# EAGLE design mini-v1.8-seed (EAGLE 7.2.0)

## Sheet 1 of 4: Main Microcontroller
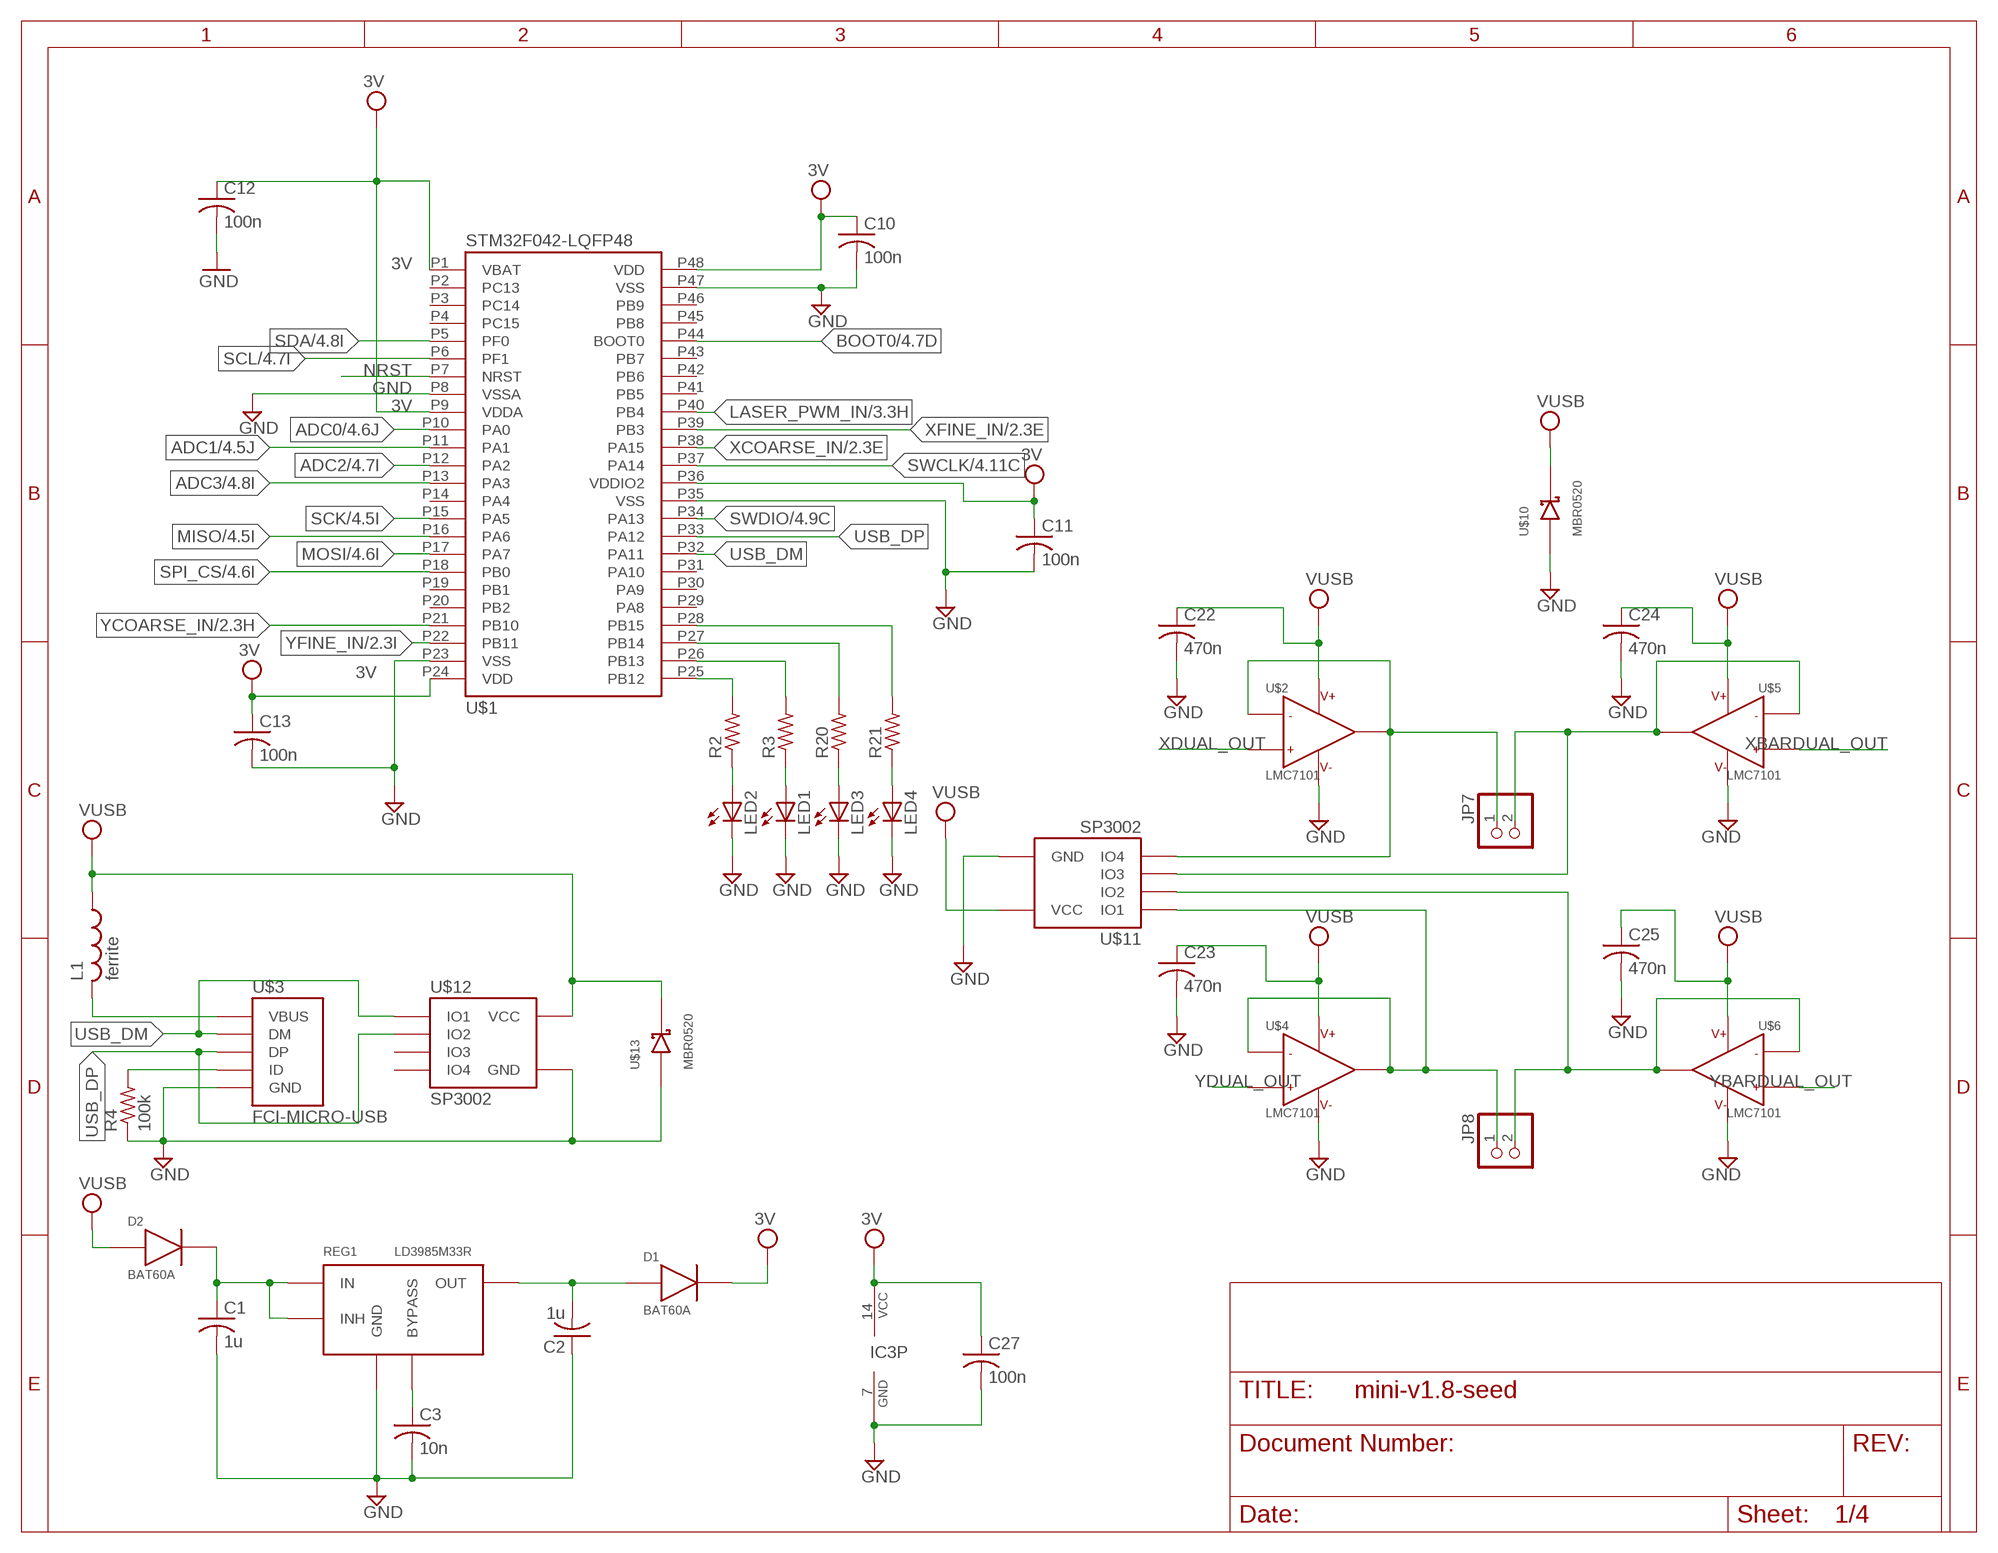
[diagram p0: schematic, sheet 1]

### Parts
C1  1u  C-USC0603  [C0603]
C2  1u  C-USC0603  [C0603]
C3  10n  C-USC0603  [C0603]
C10  100n  C-USC0603  [C0603]
C11  100n  C-USC0603  [C0603]
C12  100n  C-USC0603  [C0603]
C13  100n  C-USC0603  [C0603]
C22  470n  C-USC0603  [C0603]
C23  470n  C-USC0603  [C0603]
C24  470n  C-USC0603  [C0603]
C25  470n  C-USC0603  [C0603]
C27  100n  C-USC0603  [C0603]
D1  BAT60A  [SOD323]
D2  BAT60A  [SOD323]
IC3  74S04D  [SO14]
JP7  PINHD-1X2  [1X02]
JP8  PINHD-1X2  [1X02]
L1  ferrite  L-US  [C0603]
LED1  LEDCHIP-LED0603  [CHIP-LED0603]
LED2  LEDCHIP-LED0603  [CHIP-LED0603]
LED3  LEDCHIP-LED0603  [CHIP-LED0603]
LED4  LEDCHIP-LED0603  [CHIP-LED0603]
R2  R-US_R0603  [R0603]
R3  R-US_R0603  [R0603]
R4  100k  R-US_R0603  [R0603]
R20  R-US_R0603  [R0603]
R21  R-US_R0603  [R0603]
REG1  LD3985M33R  LD3985MXXR  [SOT23-5L]
U$1  STM32F042-LQFP48  [LQFP48]
U$2  LMC7101  [SOT23-5]
U$3  FCI-MICRO-USB  [FCI-MICROUSB]
U$4  LMC7101  [SOT23-5]
U$5  LMC7101  [SOT23-5]
U$6  LMC7101  [SOT23-5]
U$10  MBR0520  [SOD123]
U$11  SP3002  [SC70-6]
U$12  SP3002  [SC70-6]
U$13  MBR0520  [SOD123]

### Nets
3V: C10.1 C11.1 C12.1 C13.1 C27.1 D1.1 IC3.14(P:VCC) U$1.P1(VBAT) U$1.P9(VDDA) U$1.P24(VDD) U$1.P36(VDDIO2) U$1.P48(VDD) ; also sheet 4
3V3: C2.2 D1.2 REG1.OUT
ADC0: U$1.P10(PA0) ; also sheet 4
ADC1: U$1.P11(PA1) ; also sheet 4
ADC2: U$1.P12(PA2) ; also sheet 4
ADC3: U$1.P13(PA3) ; also sheet 4
BOOT0: U$1.P44(BOOT0) ; also sheet 4
GND [Power]: C1.2 C2.1 C3.2 C10.2 C11.2 C12.2 C13.2 C22.2 C23.2 C24.2 C25.2 C27.2 IC3.7(P:GND) LED1.C LED2.C LED3.C LED4.C R4.1 REG1.GND U$1.P8(VSSA) U$1.P23(VSS) U$1.P35(VSS) U$1.P47(VSS) U$2.5 U$3.P5(GND) U$4.5 U$5.5 U$6.5 U$10.ANODE U$11.P2(GND) U$12.P2(GND) U$13.ANODE ; also sheet 2,3,4
LASER_PWM_IN: U$1.P40(PB4) ; also sheet 3
MISO: U$1.P16(PA6) ; also sheet 4
MOSI: U$1.P17(PA7) ; also sheet 4
N$1: C3.1 REG1.BYPASS
N$2: R2.2 U$1.P25(PB12)
N$3: LED2.A R2.1
N$4: C1.1 D2.1 REG1.IN REG1.INHIBIT(INH)
N$5: R4.2 U$3.P4(ID)
N$7: JP7.1 U$2.1 U$2.4 U$11.P6(IO4)
N$9: JP8.1 U$4.1 U$4.4 U$11.P1(IO1)
N$12: LED1.A R3.1
N$13: R3.2 U$1.P26(PB13)
N$14: L1.2 U$3.P1(VBUS)
N$16: JP7.2 U$5.1 U$5.4 U$11.P4(IO3)
N$17: JP8.2 U$6.1 U$6.4 U$11.P3(IO2)
N$24: LED3.A R20.1
N$27: LED4.A R21.1
N$28: R20.2 U$1.P27(PB14)
N$29: R21.2 U$1.P28(PB15)
NRST: U$1.P7(NRST) ; also sheet 4
SCK: U$1.P15(PA5) ; also sheet 4
SCL: U$1.P6(PF1) ; also sheet 4
SDA: U$1.P5(PF0) ; also sheet 4
SPI_CS: U$1.P18(PB0) ; also sheet 4
SWCLK: U$1.P37(PA14) ; also sheet 4
SWDIO: U$1.P34(PA13) ; also sheet 4
USB_DM: U$1.P32(PA11) U$3.P2(DM) U$12.P1(IO1)
USB_DP: U$1.P33(PA12) U$3.P3(DP) U$12.P3(IO2)
VUSB [Power]: C22.1 C23.1 C24.1 C25.1 D2.2 L1.1 U$2.2 U$4.2 U$5.2 U$6.2 U$10.CATHODE U$11.P5(VCC) U$12.P5(VCC) U$13.CATHODE ; also sheet 3
XBARDUAL_OUT: U$5.3 ; also sheet 2
XCOARSE_IN: U$1.P38(PA15) ; also sheet 2
XDUAL_OUT: U$2.3 ; also sheet 2
XFINE_IN: U$1.P39(PB3) ; also sheet 2
YBARDUAL_OUT: U$6.3 ; also sheet 2
YCOARSE_IN: U$1.P21(PB10) ; also sheet 2
YDUAL_OUT: U$4.3 ; also sheet 2
YFINE_IN: U$1.P22(PB11) ; also sheet 2
Unconnected: U$1.P2(PC13) U$1.P3(PC14) U$1.P4(PC15) U$1.P14(PA4) U$1.P19(PB1) U$1.P20(PB2) U$1.P29(PA8) U$1.P30(PA9) U$1.P31(PA10) U$1.P41(PB5) U$1.P42(PB6) U$1.P43(PB7) U$1.P45(PB8) U$1.P46(PB9) U$12.P4(IO3) U$12.P6(IO4)

## Sheet 2 of 4: Dual PWM
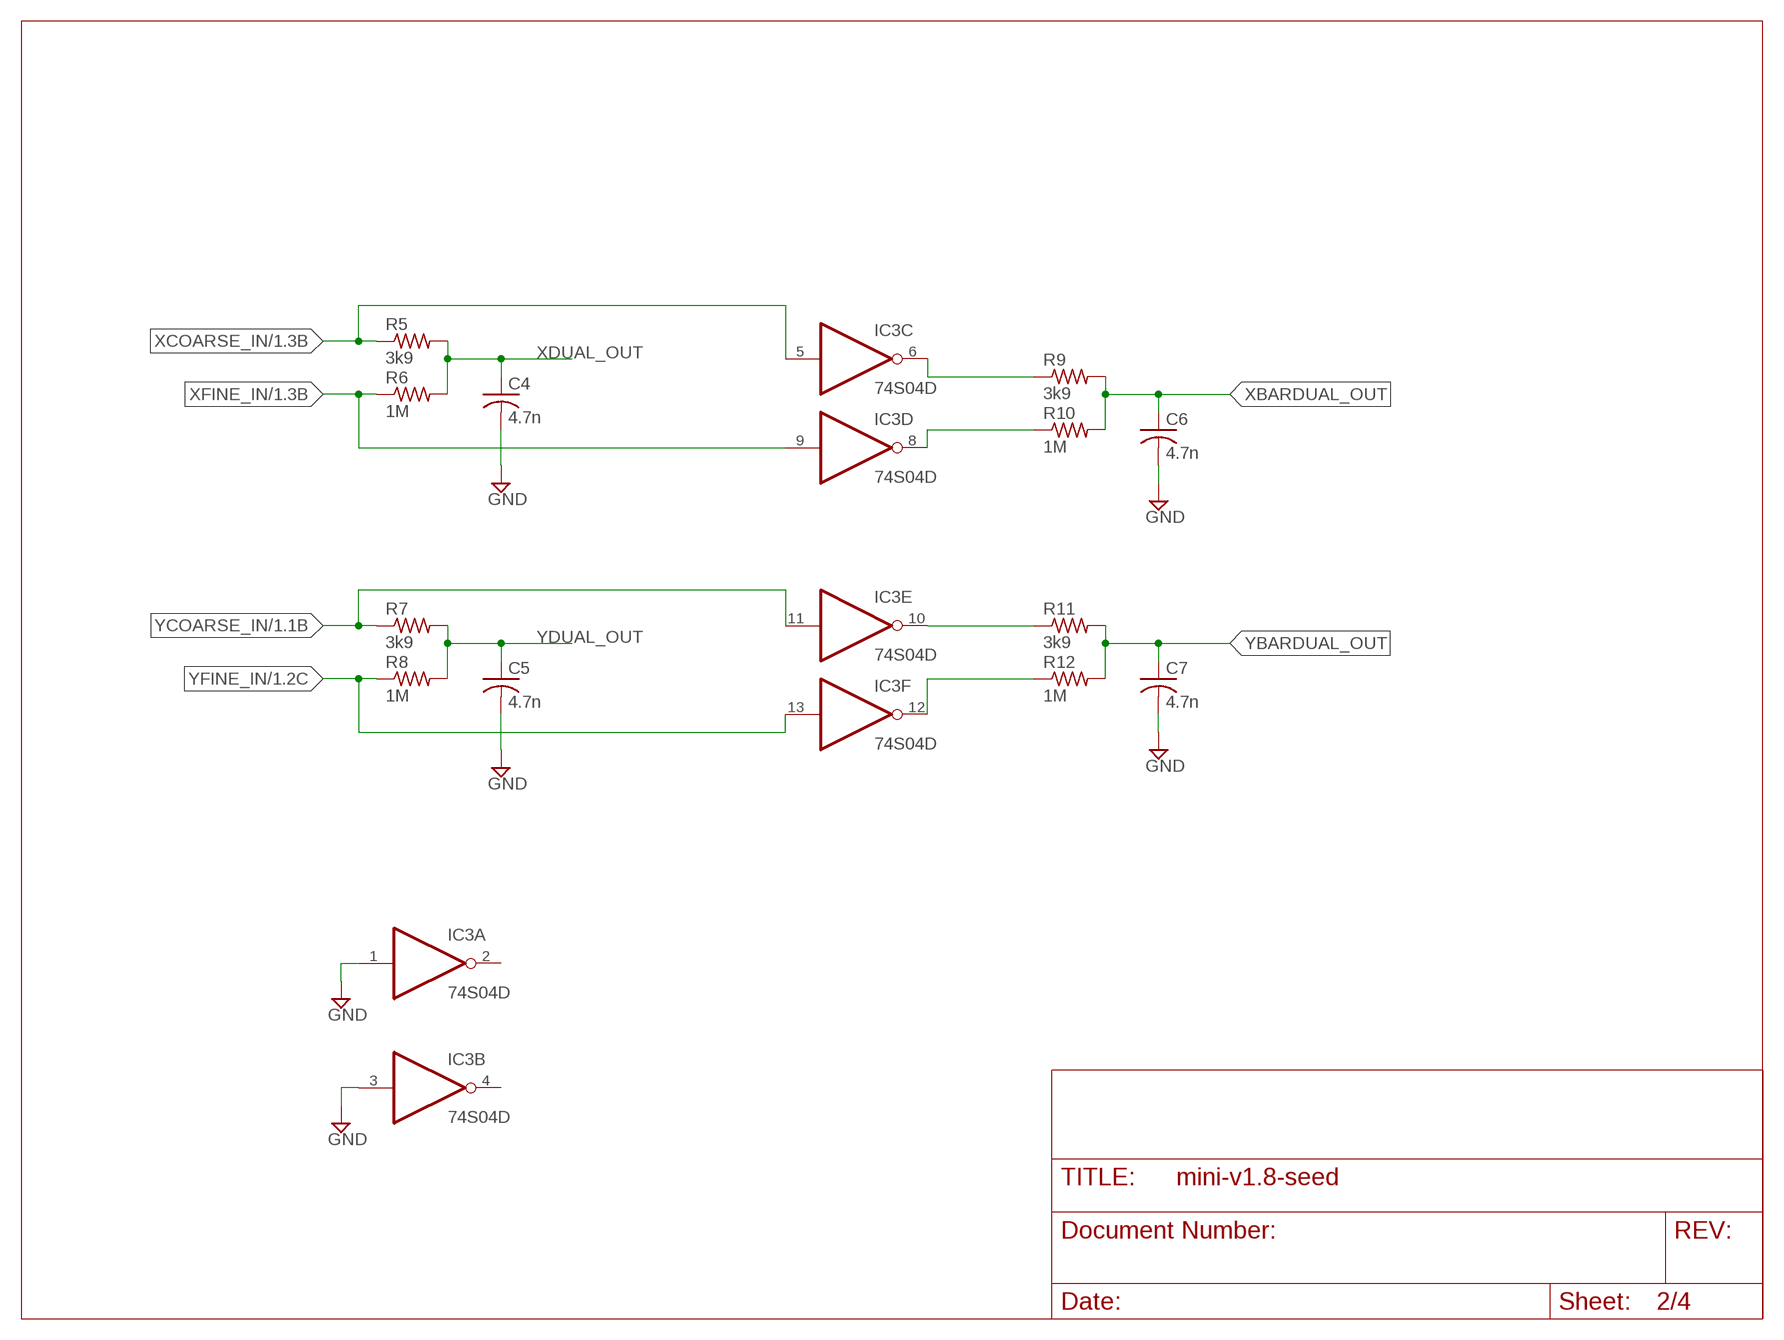
[diagram p1: schematic, sheet 2]

### Parts
C4  4.7n  C-USC0603  [C0603]
C5  4.7n  C-USC0603  [C0603]
C6  4.7n  C-USC0603  [C0603]
C7  4.7n  C-USC0603  [C0603]
R5  3k9  R-US_R0603  [R0603]
R6  1M  R-US_R0603  [R0603]
R7  3k9  R-US_R0603  [R0603]
R8  1M  R-US_R0603  [R0603]
R9  3k9  R-US_R0603  [R0603]
R10  1M  R-US_R0603  [R0603]
R11  3k9  R-US_R0603  [R0603]
R12  1M  R-US_R0603  [R0603]

### Nets
GND [Power]: C4.2 C5.2 C6.2 C7.2 IC3.1(A:I) IC3.3(B:I) ; also sheet 1,3,4
N$6: IC3.10(E:O) R11.1
N$8: IC3.12(F:O) R12.1
N$10: IC3.8(D:O) R10.1
N$11: IC3.6(C:O) R9.1
XBARDUAL_OUT: C6.1 R9.2 R10.2 ; also sheet 1
XCOARSE_IN: IC3.5(C:I) R5.1 ; also sheet 1
XDUAL_OUT: C4.1 R5.2 R6.2 ; also sheet 1
XFINE_IN: IC3.9(D:I) R6.1 ; also sheet 1
YBARDUAL_OUT: C7.1 R11.2 R12.2 ; also sheet 1
YCOARSE_IN: IC3.11(E:I) R7.1 ; also sheet 1
YDUAL_OUT: C5.1 R7.2 R8.2 ; also sheet 1
YFINE_IN: IC3.13(F:I) R8.1 ; also sheet 1
Unconnected: IC3.2(A:O) IC3.4(B:O)

## Sheet 3 of 4: Laser Power Driver
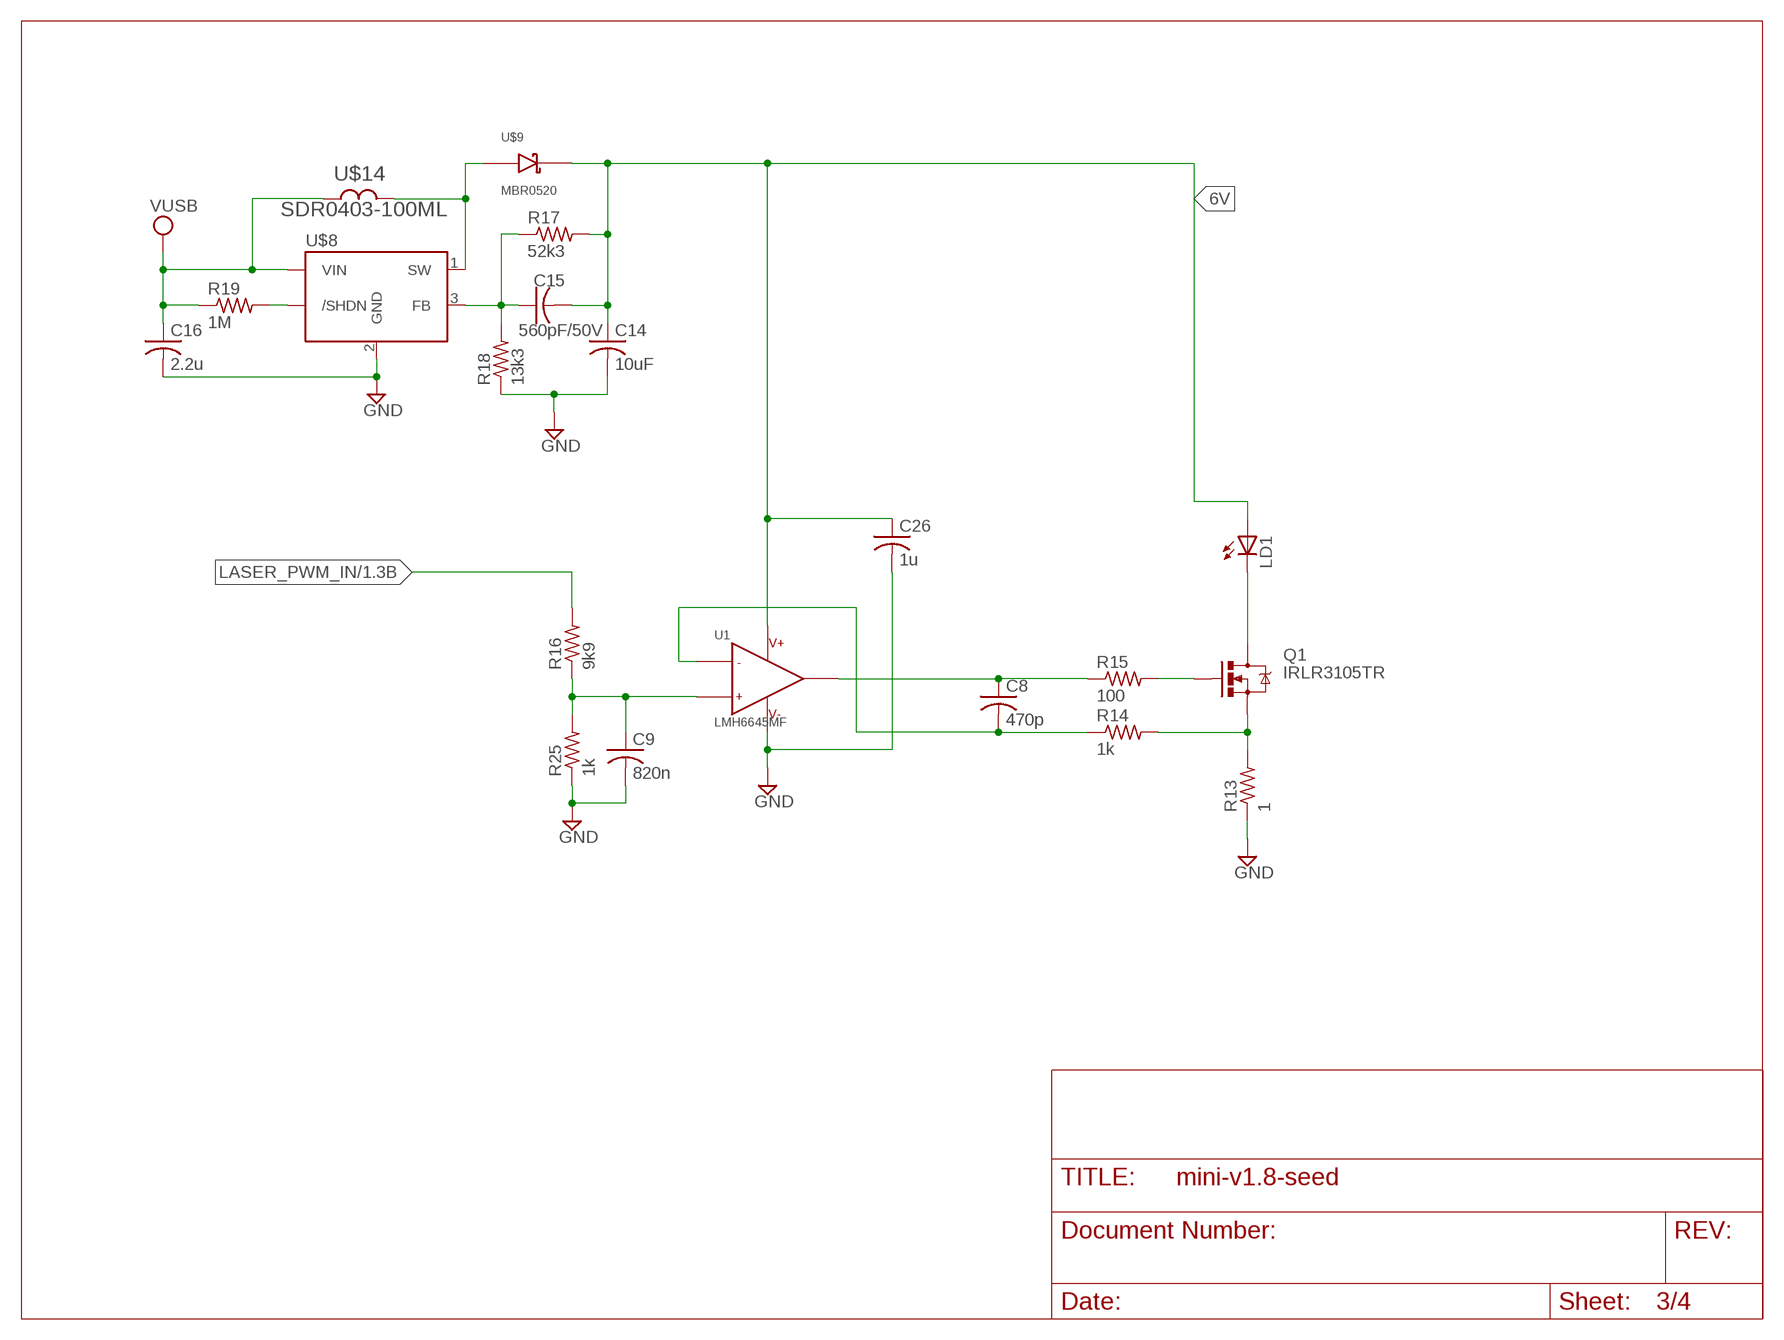
[diagram p2: schematic, sheet 3]

### Parts
C8  470p  C-USC0603  [C0603]
C9  820n  C-USC0603  [C0603]
C14  10uF  C-USC0603  [C0603]
C15  560pF/50V  C-USC0603  [C0603]
C16  2.2u  C-USC0603  [C0603]
C26  1u  C-USC0603  [C0603]
LD1  LASERDIODELD2  [LASERDIODE2]
Q1  IRLR3105TR  FET-N-IRLR3105TRIRLR3105TR  [DPAK]
R13  1  R-US_R0603  [R0603]
R14  1k  R-US_R0603  [R0603]
R15  100  R-US_R0603  [R0603]
R16  9k9  R-US_R0603  [R0603]
R17  52k3  R-US_R0603  [R0603]
R18  13k3  R-US_R0603  [R0603]
R19  1M  R-US_R0603  [R0603]
R25  1k  R-US_R0603  [R0603]
U1  LMH6645MF  OPAMP-SINGLELMH6645MF  [SOT23-5]
U$8  LMR62014  [SOT23-5]
U$9  MBR0520  [SOD123]
U$14  SDR0403-100ML  SDR0403  [SDR0403]

### Nets
6V [Power]: C14.1 C15.2 C26.1 LD1.P$1(A) R17.2 U1.5(V+) U$9.CATHODE
GND [Power]: C9.2 C14.2 C16.2 C26.2 R13.1 R18.1 R25.1 U1.2(V-) U$8.2(GND) ; also sheet 1,2,4
LASER_PWM_IN: R16.2 ; also sheet 1
N$15: U$8.1(SW) U$9.ANODE U$14.P$2
N$18: LD1.P$3(C) Q1.4(D)
N$19: Q1.3(S) R13.2 R14.2
N$20: C8.2 R14.1 U1.4(IN-)
N$21: Q1.1(G) R15.2
N$22: C8.1 R15.1 U1.1(OUT)
N$23: C9.1 R16.1 R25.2 U1.3(IN+)
N$25: C15.1 R17.1 R18.2 U$8.3(FB)
N$26: R19.2 U$8.4(/SHDN)
VUSB [Power]: C16.1 R19.1 U$8.5(VIN) U$14.P$1 ; also sheet 1

## Sheet 4 of 4
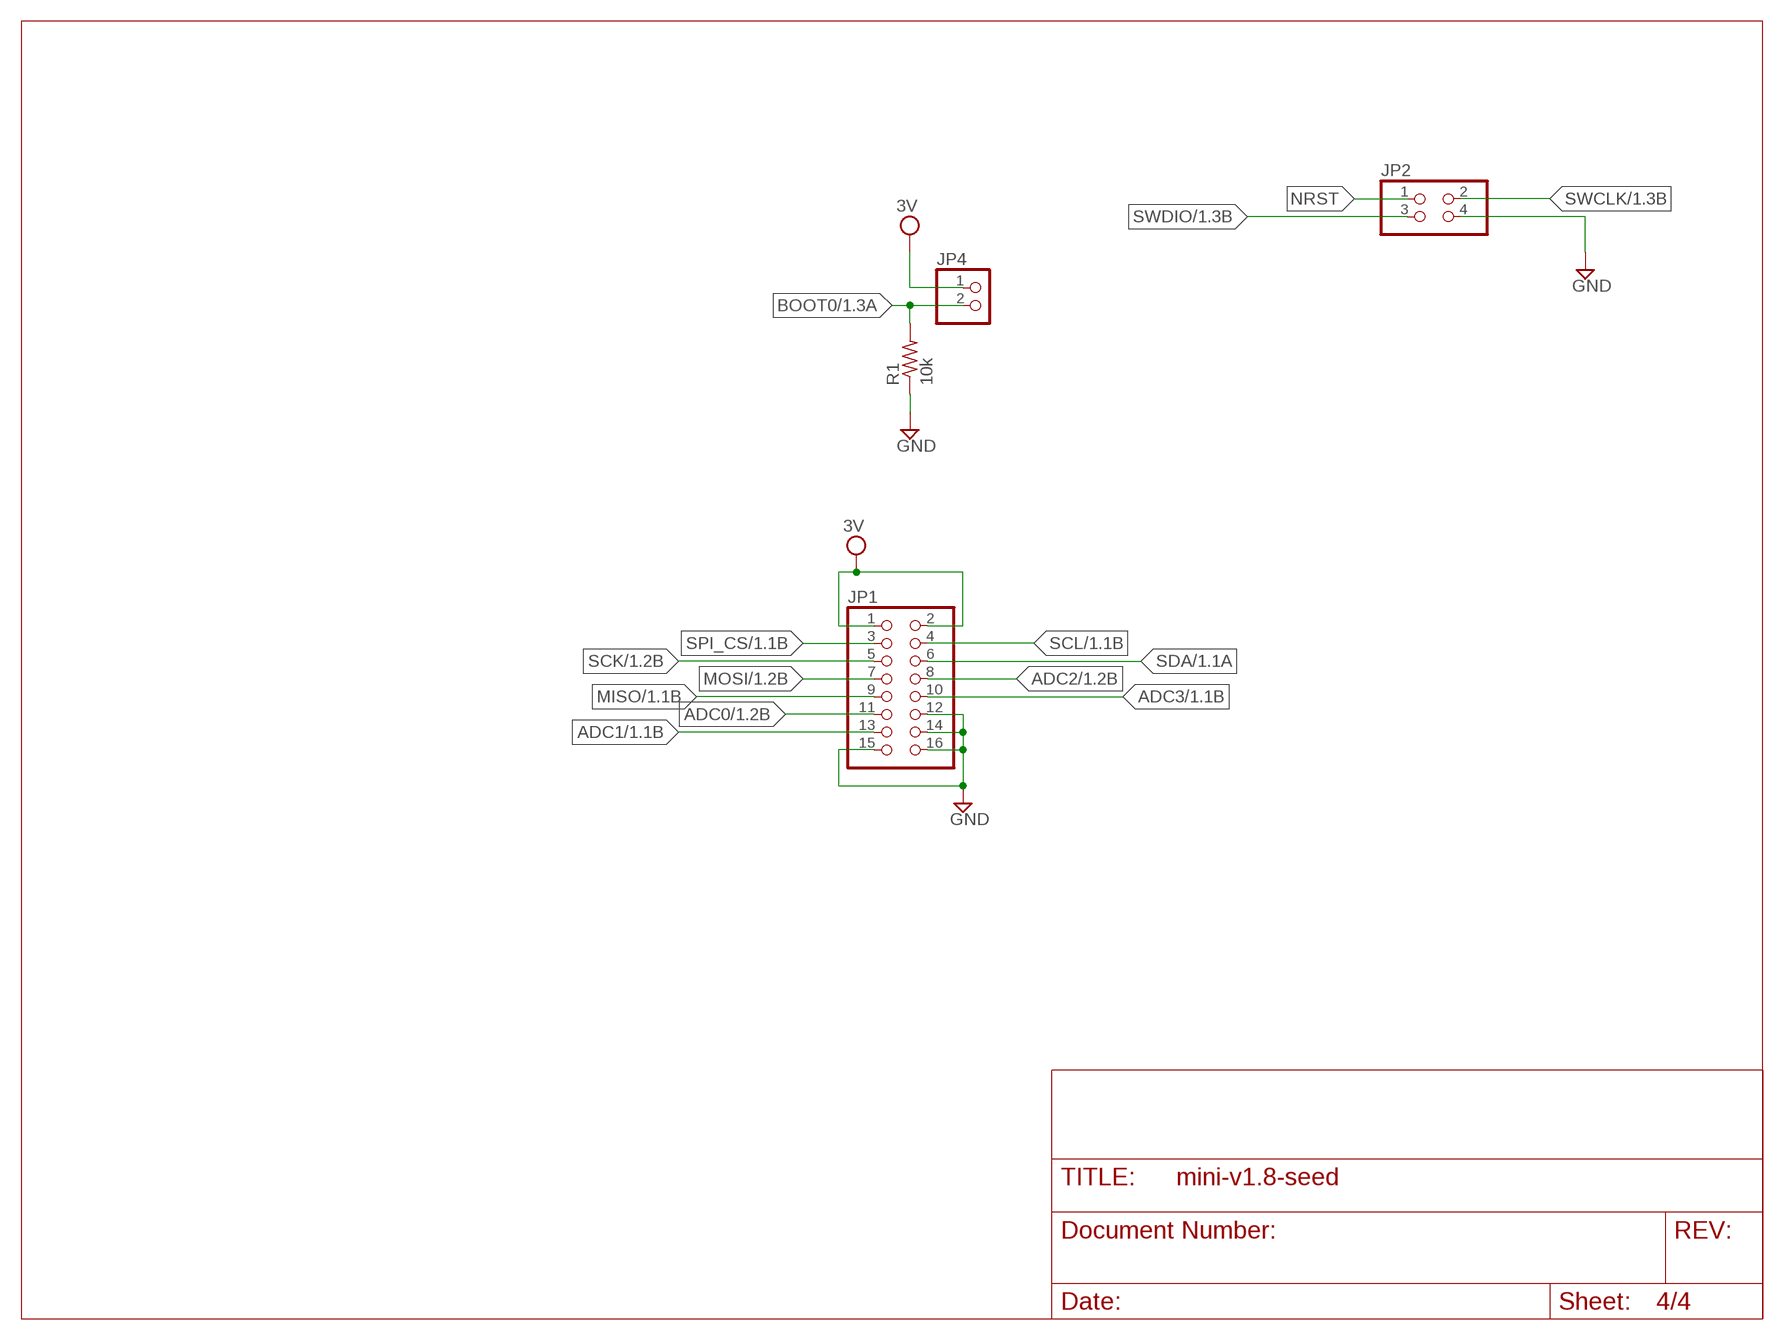
[diagram p3: schematic, sheet 4]

### Parts
JP1  PINHD-2X8  [2X08]
JP2  PINHD-2X2  [2X02]
JP4  PINHD-1X2  [1X02]
R1  10k  R-US_R0603  [R0603]

### Nets
3V: JP1.1 JP1.2 JP4.1 ; also sheet 1
ADC0: JP1.11 ; also sheet 1
ADC1: JP1.13 ; also sheet 1
ADC2: JP1.8 ; also sheet 1
ADC3: JP1.10 ; also sheet 1
BOOT0: JP4.2 R1.2 ; also sheet 1
GND [Power]: JP1.12 JP1.14 JP1.15 JP1.16 JP2.4 R1.1 ; also sheet 1,2,3
MISO: JP1.9 ; also sheet 1
MOSI: JP1.7 ; also sheet 1
NRST: JP2.1 ; also sheet 1
SCK: JP1.5 ; also sheet 1
SCL: JP1.4 ; also sheet 1
SDA: JP1.6 ; also sheet 1
SPI_CS: JP1.3 ; also sheet 1
SWCLK: JP2.2 ; also sheet 1
SWDIO: JP2.3 ; also sheet 1

## Library data of the parts
C1-C16 C22-C27 = rcl:C-US: CAPACITOR, American symbol
D1 D2 = lmdparts:BAT60A
IC3 = lmdparts:74*04: Hex INVERTER
JP1 = pinhead:PINHD-2X8: PIN HEADER
JP2 = pinhead:PINHD-2X2: PIN HEADER
JP4 JP7 JP8 = pinhead:PINHD-1X2: PIN HEADER
L1 = lmdparts:L-US: INDUCTOR, American symbol
LD1 = Scott:LASERDIODE; MPN: 3 x (0552-2-15-15-11-27-10-0)
LED1-LED4 = adafruit:LED: LED OSRAM: - CHIPLED LG R971, LG N971, LY N971, LG Q971, LY Q971, LO R971, LY R971 LH N974, LH R974 LS Q976, LO Q976, LY Q976 LO Q996 - Hyper CHIPLED LW Q18S LB Q993, LB Q99A, LB R99A - SideLED LS A670, LO A670, LY A670, LG A670, LP A670 LB A673, LV A673, LT A673, LW A673 LH A674 LY A675 LS A676, LA A676, LO A676, LY A676, LW A676 LS A679, LY A679, LG A679 - Hyper Micro SIDELED® LS Y876, LA Y876, LO Y876, LY Y876 LT Y87S - SmartLED LW L88C, LW L88S LB L89C, LB L89S, LG L890 LS L89K, LO L89K, LY L89K LS L896, LA L896, LO L896, LY L896 - TOPLED LS T670, LO T670, LY T670, LG T670, LP T670 LSG T670, LSP T670, LSY T670, LOP T670, LYG T670 LG T671, LOG T671, LSG T671 LB T673, LV T673, LT T673, LW T673 LH T674 LS T676, LA T676, LO T676, LY T676, LB T676, LH T676, LSB T676, LW T676 LB T67C, LV T67C, LT T67C, LS T67K, LO T67K, LY T67K, LW E67C LS E67B, LA E67B, LO E67B, LY E67B, LB E67C, LV E67C, LT E67C LW T67C LS T679, LY T679, LG T679 LS T770, LO T770, LY T770, LG T770, LP T770 LB T773, LV T773, LT T773, LW T773 LH T774 LS E675, LA E675, LY E675, LS T675 LS T776, LA T776, LO T776, LY T776, LB T776 LHGB T686 LT T68C, LB T68C - Hyper Mini TOPLED® LB M676 - Mini TOPLED Santana® LG M470 LS M47K, LO M47K, LY M47K Source: http://www.osram.convergy.de/
Q1 = lmdparts:FET-N-IRLR3105TR: Common NMOSFET Parts MFG P/N Store ID Prod ID FDD8780 TRANS-09984 SI7820DN TRANS-11055 FDS6630A IC-08089 2N7002PW TRANS-11151 FQP30N06L COM-10213 TRANS-10060 BSS123LT1G TRANS-08345 BSS138 TRANS-00830 BS170 2N7000; PROD_ID: TRANS-09984
R1-R21 R25 = rcl:R-US_: RESISTOR, American symbol
REG1 = lmdparts:LD3985MXXR
U1 = lmdparts:OPAMP-SINGLE: Single amp opamps
U$1 = lmdparts:STM32F042-LQFP48
U$2 U$4-U$6 = lmdparts:LMC7101
U$3 = lmdparts:FCI-MICRO-USB
U$8 = lmdparts:LMR62014
U$9 U$10 U$13 = lmdparts:MBR0520
U$11 U$12 = lmdparts:SP3002
U$14 = lmdparts:SDR0403

## Net classes
1 Power: width 0.305 mm

## Board
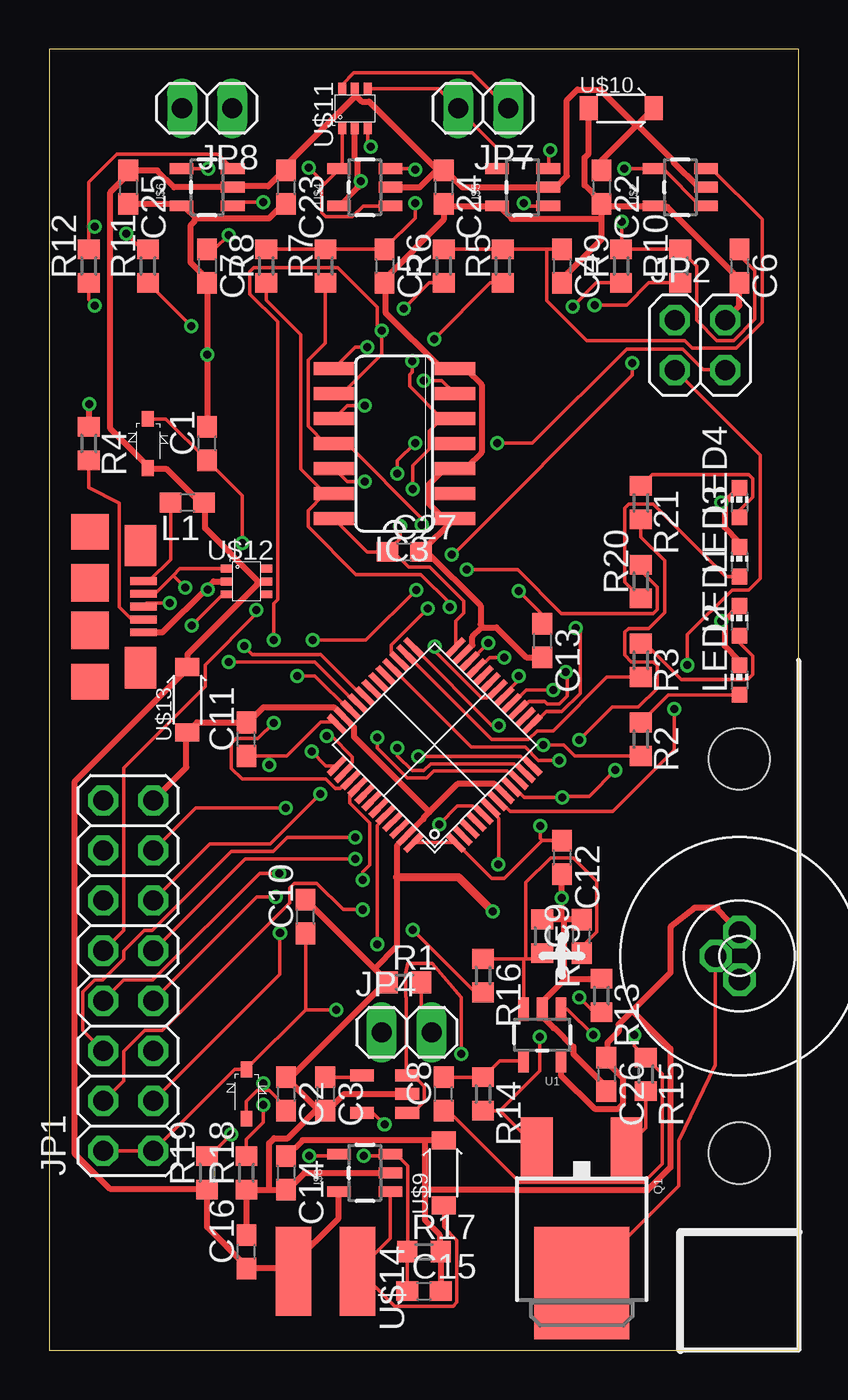
[diagram p4: board, top side]
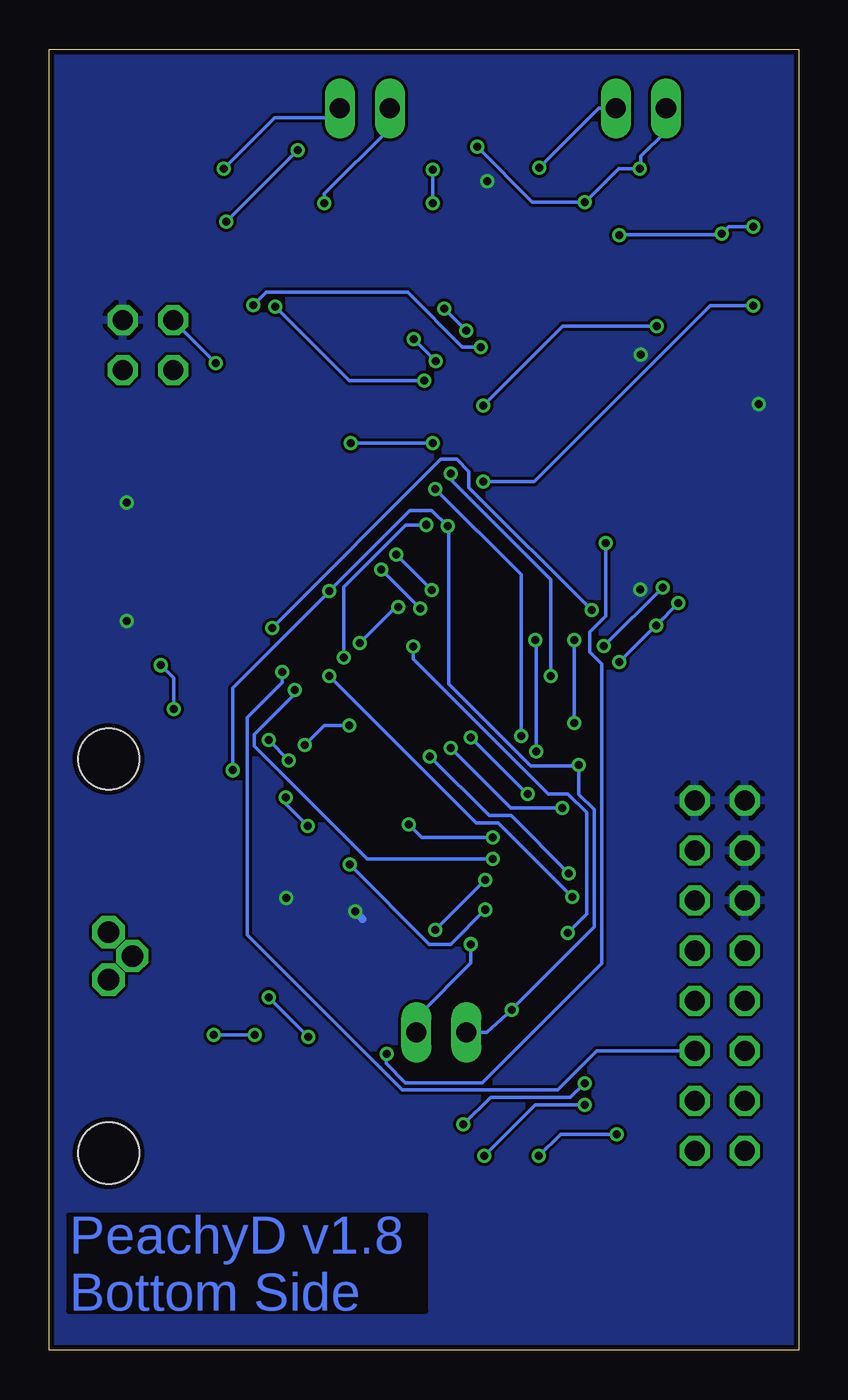
[diagram p5: board, bottom side, seen from below]

Size 38.01 x 66 mm. Coordinates in mm from the lower left corner, seen from the top.
Outline: 0,0 38.01,0 38,66 0,66 0,0
Copper layers (1*16): Top 0.035mm / dielectric 1.5mm / Bottom 0.035mm
Design rules "SeeedStudio_2layer_DRU_no_angle_20140221": minimum track width 6mil, minimum drill 12mil, track to track 6mil, track to pad 6mil, pad to pad 6mil, via to via 6mil, smd to smd 0mil, copper to edge 10mil, drill to drill 10mil, minimum pad ring 10mil, minimum via ring 6mil, stop-mask expansion 2mil, vias tented up to drill 100mil, thermal gap 10mil
Holes 3.1 mm at 35,10 35,30

### Footprints (pad centres in the part's own frame; a part is rotated, then mirrored left to right if it is on the bottom)
C0603 = smd 1.1 x 1: 1 -0.85,0; 2 0.85,0
SOD323 = smd 0.6 x 0.8: 1 0,1.25; 2 0,-1.25
SO14 = smd 0.66 x 2.032: 1 -3.81,-3.073; 2 -2.54,-3.073; 3 -1.27,-3.073; 4 0,-3.073; 5 1.27,-3.073; 6 2.54,-3.073; 7 3.81,-3.073; 8 3.81,3.073; 9 2.54,3.073; 10 1.27,3.073; 11 0,3.073; 12 -1.27,3.073; 13 -2.54,3.073; 14 -3.81,3.073
2X08 = drill 1.016 octagon: 1 -8.89,-1.27; 2 -8.89,1.27; 3 -6.35,-1.27; 4 -6.35,1.27; 5 -3.81,-1.27; 6 -3.81,1.27; 7 -1.27,-1.27; 8 -1.27,1.27; 9 1.27,-1.27; 10 1.27,1.27; 11 3.81,-1.27; 12 3.81,1.27; 13 6.35,-1.27; 14 6.35,1.27; 15 8.89,-1.27; 16 8.89,1.27
2X02 = drill 1.016 octagon: 1 -1.27,-1.27; 2 -1.27,1.27; 3 1.27,-1.27; 4 1.27,1.27
1X02 = drill 1.016 long: 1 -1.27,0; 2 1.27,0
LASERDIODE2 = drill 1.092 pad 1.499 octagon: P$1 0,1.203; P$2 0,-1.203; P$3 -1.203,0
CHIP-LED0603 = smd 0.8 x 0.8: A 0,-0.75; C 0,0.75
DPAK = smd 1.6 x 3: 1 -2.28,-5.31; 3 2.28,-5.31 | smd 4.826 x 5.715: 4 0,1.588
R0603 = smd 1 x 1.1: 1 -0.85,0; 2 0.85,0
SOT23-5L = smd 0.6 x 1.2: BYPASS -0.95,-1.15; GND 0,1.15; IN 0.95,1.15; INHIBIT -0.95,1.15; OUT 0.95,-1.15
SOT23-5 = smd 0.55 x 1.2: 1 -0.95,-1.3; 2 0,-1.3; 3 0.95,-1.3; 4 0.95,1.3; 5 -0.95,1.3
LQFP48 = smd 0.3 x 1.2: P1 -2.75,-0.6; P2 -2.25,-0.6; P3 -1.75,-0.6; P4 -1.25,-0.6; P5 -0.75,-0.6; P6 -0.25,-0.6; P7 0.25,-0.6; P8 0.75,-0.6; P9 1.25,-0.6; P10 1.75,-0.6; P11 2.25,-0.6; P12 2.75,-0.6; P25 2.75,7.9; P26 2.25,7.9; P27 1.75,7.9; P28 1.25,7.9; P29 0.75,7.9; P30 0.25,7.9; P31 -0.25,7.9; P32 -0.75,7.9; P33 -1.25,7.9; P34 -1.75,7.9; P35 -2.25,7.9; P36 -2.75,7.9 | smd 1.2 x 0.3: P13 4.25,0.9; P14 4.25,1.4; P15 4.25,1.9; P16 4.25,2.4; P17 4.25,2.9; P18 4.25,3.4; P19 4.25,3.9; P20 4.25,4.4; P21 4.25,4.9; P22 4.25,5.4; P23 4.25,5.9; P24 4.25,6.4; P37 -4.25,6.4; P38 -4.25,5.9; P39 -4.25,5.4; P40 -4.25,4.9; P41 -4.25,4.4; P42 -4.25,3.9; P43 -4.25,3.4; P44 -4.25,2.9; P45 -4.25,2.4; P46 -4.25,1.9; P47 -4.25,1.4; P48 -4.25,0.9
FCI-MICROUSB = smd 0.4 x 1.35: P1 -1.3,2.7; P2 -0.65,2.7; P3 0,2.7; P4 0.65,2.7; P5 1.3,2.7 | smd 1.8 x 1.9: P$1 3.8,0; P$2 -3.8,0 | smd 1.9 x 1.9: P$3 -1.2,0; P$4 1.2,0 | smd 2.1 x 1.6: P$5 -3.1,2.55; P$6 3.1,2.55
SOD123 = smd 0.91 x 1.22: ANODE -1.65,0; CATHODE 1.65,0
SC70-6 = smd 0.4 x 0.6: P1 -0.65,-1; P2 0,-1; P3 0.65,-1; P4 0.65,1; P5 0,1; P6 -0.65,1
SDR0403 = smd 4.5 x 1.8: P$1 0,1.625; P$2 0,-1.625

### Placement (x,y rotation side)
C1  8,46 90 top
C2  12,13 270 top
C3  14,13 270 top
C4  26,55 270 top
C5  17,55 270 top
C6  35,55 270 top
C7  8,55 270 top
C8  20,13 90 top
C9  27,21 90 top
C10  13,22 90 top
C11  10,31 90 top
C12  26,25 270 top
C13  25,36 270 top
C14  12,9 270 top
C15  19,3 0 top
C16  10,5 90 top
C22  28,59 270 top
C23  12,59 270 top
C24  20,59 270 top
C25  4,59 270 top
C26  28.25,14 270 top
C27  18,40.5 0 top
D1  10,13 0 top
D2  5,46 0 top
IC3  17.5,46 90 top
JP1  4,19 90 top
JP2  33,51 0 top
JP4  18.12,16.12 0 top
JP7  22,63 180 top
JP8  8,63 180 top
L1  7,43 180 top
LD1  35,20 0 top
LED1  35,37 0 top
LED2  35,34 0 top
LED3  35,40 0 top
LED4  35,43 0 top
Q1  27,5 180 top
R1  18.02,18.66 0 top
R2  30,31 270 top
R3  30,35 270 top
R4  2,46 270 top
R5  23,55 90 top
R6  20,55 90 top
R7  14,55 90 top
R8  11,55 90 top
R9  29,55 90 top
R10  32,55 90 top
R11  5,55 90 top
R12  2,55 90 top
R13  28,18 270 top
R14  22,13 270 top
R15  30.25,14 270 top
R16  22,19 270 top
R17  19,5 0 top
R18  10,9 90 top
R19  8,9 90 top
R20  30,39 90 top
R21  30,43 270 top
R25  25,21 270 top
REG1  17,13 270 top
U1  25,16 180 top
U$1  22.12,28.12 45 top
U$2  32,59 90 top
U$3  2.07,37.73 270 top
U$4  16,59 90 top
U$5  24,59 90 top
U$6  8,59 90 top
U$8  16,9 90 top
U$9  20,9 90 top
U$10  29,63 0 top
U$11  15.5,63 0 top
U$12  10,39 270 top
U$13  7,33 90 top
U$14  14,4 90 top

### Tracks (layer width: path | path; a pad name or v marks a point on that pad's centre or on a via)
3V  (via drill 0.41)
  Top 0.178: 25,25.85 C12.1 | 25,25.85 23.07,23.93 22.45,23.93 20.62,25.75 U$1.P1 20.52,25.75 18.5,25.75 U$1.P48 | v24.9,26.6 24.9,25.98 24.95,25.93 25,25.85 | U$1.P9 23.45,28.57 23.55,28.57 24.07,28.05 v26.02,28.05 26.1,28.1 27.38,28.1 v28.7,29.43 | C27.1 16.12,40.5 14.45,42.17 IC3.14 | C13.1 25,37.33 v23.8,38.52 | v17.8,41.8 17.8,41.17 17.2,40.58 C27.1 | U$1.P24 20.62,35.67 20.62,37 21.02,37.4 21.02,38 19.3,39.73 18.23,39.73 17.35,40.6 C27.1 | 11.15,30.15 12.05,30.15 13.78,31.88 14.47,31.88 14.57,31.77 U$1.P36 | 11.15,30.15 C11.1 | 13,17.27 C10.1 | 13,17.27 10.05,14.32 D1.1 9.4,14.25 5.28,10.12 JP1.1 5.2,10.12 2.75,10.12 JP1.2 | 13,17.27 v14.55,17.27 | v11.15,29.7 11.15,30.15
  Bottom 0.178: v26.02,28.05 26.02,27.73 v24.9,26.6 | v28.7,29.43 28.7,33.6 23.85,38.45 v23.8,38.52 19.73,42.6 18.6,42.6 v17.8,41.8 17.75,41.73 17.75,33.8 13.6,29.65 11.22,29.65 v11.15,29.7 11.15,28.2 10.38,27.43 10.38,21.48 14.5,17.35 v14.55,17.27 15.82,16.12 JP4.1
3V3  (via drill 0.41)
  Top 0.178: D1.2 10,12.62 10.55,13.18 10.85,13.18 | 10.85,13.18 11.15,13.18 12,12.32 C2.2 | REG1.OUT 16.4,12.05 v17,11.45 | 10.85,13.18 v10.85,13.55
  Bottom 0.178: v17,11.45 15.62,12.82 11.57,12.82 v10.85,13.55
6V
  Top 0.305: C15.2 R17.2 19.8,5.15 19.8,5.85 19.05,6.6 19.05,8.15 | C14.1 12.05,9.85 12.85,10.65 19.05,10.65 | U$9.CATHODE 19.05,10.65 | 19.05,10.65 19.05,8.15 | U1.5 25.95,13.95 27.65,12.25 28.85,12.25 29.1,12.5 29.1,13.8 28.25,14.65 C26.1 28.3,15 28.3,15.6 28.88,16.18 28.88,16.52 29.57,17.23 | 29.57,17.23 31.5,19.15 31.5,21.48 32.73,22.45 33.88,22.45 33.88,22.38 LD1.P$1 | 19.05,8.15 23.62,8.15 23.68,8.1 30.32,8.1 31.5,9.28 31.5,15.3 29.57,17.23
ADC0  (via drill 0.41)
  Top 0.178: v16.62,31.07 16.62,30.55 18.15,29.02 19.15,29.02 19.5,29.38 23.23,29.38 23.65,28.95 23.77,28.95 U$1.P10 | v13.75,28.23 11.2,25.68 8.12,25.68 5.28,22.82 JP1.11
  Bottom 0.178: v16.62,31.07 13.78,28.23 v13.75,28.23
ADC1  (via drill 0.41)
  Top 0.178: v17.65,30.55 17.65,30.15 18.4,29.4 19,29.4 19.35,29.75 23.57,29.75 24.02,29.3 24.12,29.3 U$1.P11 | v12,27.5 7.42,27.5 JP1.13
  Bottom 0.178: v17.65,30.55 14.6,27.5 v12,27.5
ADC2  (via drill 0.41)
  Top 0.178: v18.7,30.12 23.9,30.12 24.38,29.65 24.48,29.65 U$1.P12 | v11.65,24.2 10.68,24.2 5.25,18.77 3.77,18.77 JP1.8
  Bottom 0.178: v18.7,30.12 15.7,27.12 14.57,27.12 v11.65,24.2
ADC3  (via drill 0.41)
  Top 0.178: v26.7,36.65 26.93,36.42 26.93,33.33 26,32.4 25.2,32.4 24.57,31.77 24.5,31.77 U$1.P13 | v10.5,37.55 10.5,37.38 7.9,34.77 7.9,33.67 3.77,29.55 3.77,21.3 2.75,20.27 JP1.10
  Bottom 0.178: v26.7,36.65 18.15,45.2 17.35,45.2 16.73,44.58 16.73,43.77 v10.5,37.55
BOOT0  (via drill 0.41)
  Top 0.178: R1.2 18.88,18.52 18.88,16.38 19.25,16 JP4.2 | v16.62,20.6 16.62,26.62 17.05,27.05 17.05,27.15 U$1.P44
  Bottom 0.178: v16.62,20.6 16.62,19.65 19.25,17.02 19.25,16 JP4.2
GND  (via drill 0.41)
  Top 0.305: C13.2 24.2,35.15 22.68,36.67 21.93,36.67 | 21.93,36.67 21.45,36.2 21.45,35.77 20.98,35.3 U$1.P23 | 21.93,36.67 21.88,36.83 21.88,37.77 19.1,40.55 C27.2 20.55,42.2 IC3.1 20.18,42.02 19.23,42.98 19.23,43.9 20.05,44.73 20.55,44.73 IC3.3 20.7,44.83 21.2,44.83 21.93,45.55 21.93,48.98 21.12,49.77 20.73,49.77 IC3.7 20.55,49.83 19.88,49.83 17.05,52.65 17.05,54 C5.2 17,54.35 20,57.35 C24.2 20.15,58.05 U$5.5 22.85,58 23.45,57.4 28,57.4 | C4.2 26,54.35 28,56.35 28,57.4 | C22.2 28,57.4 | C22.2 28.15,58.05 U$2.5 30.85,58 31.35,58 34.95,54.4 34.95,54.3 C6.2 35,53 JP2.4 | U$10.ANODE 27.35,60.7 27.15,60.5 27.15,59.1 27.95,58.3 C22.2 | C10.2 16.5,19.35 | 16.5,19.35 17.15,18.7 17.15,18.55 R1.1 17,18.5 16.9,18.5 12.22,13.82 C2.1 13.6,12.25 | 13.6,12.25 13.7,12.15 C3.2 14.15,12.2 14.95,13 REG1.GND | C16.2 R18.1 11.15,8.15 | 11.15,8.15 C14.2 12.15,8.2 12.95,9 U$8.2 | 13.6,12.25 12.1,10.75 11.4,10.75 11.15,10.5 11.15,8.15 | 19.27,27.3 20.7,28.73 22.6,28.73 23.07,28.25 U$1.P8 | 19.27,27.3 18.98,27 18.98,26.95 18.15,26.12 U$1.P47 18.02,26 17.62,25.6 17.62,24 17.62,20.48 16.5,19.35 | 19.27,27.3 15.45,31.12 15.45,31.6 15.05,32 U$1.P35 14.93,32.12 14.43,32.62 10.88,32.62 10.15,31.9 C11.2 7.5,31.85 U$13.ANODE 6.95,31.2 6.95,29.57 JP1.15 | C1.2 v8,50.5 C7.2 7.95,54.3 7.95,54.4 7.15,55.2 7.15,57.05 7.38,57.27 7.42,57.42 | C25.2 6.58,58.15 6.67,58.05 U$6.5 6.85,58 7.42,57.42 | C23.2 11.88,58.15 11.15,57.42 7.42,57.42 | C9.2 26.12,21.85 | 26.12,21.85 26,21.85 | 26,21.85 R25.1 | 26,21.85 v26,22.95 C12.2 | C26.2 28.25,13.35 26.57,15.03 26.57,15.4 25.62,16.35 25.57,16.35 25,16.93 U1.2 25.05,17.45 25.05,17.73 26.18,18.85
  Top 0.305: 26.18,18.85 R13.1 | 26.12,21.85 26.12,19 26.18,18.85 | U$12.P2 8.32,39 7.97,38.65 | 7.97,38.65 5.75,36.42 U$3.P5 | U$11.P2 15.5,60.48 15.65,60.33 15.65,59.3 | 15.65,59.3 15.65,59 U$4.5 | U$4.5 | LED3.C 35,41 34.25,41.75 34.25,43 | LED4.C 34.25,43 | LED2.C 35,35 34.25,35.75 34.25,37 | LED1.C 34.25,37 | R4.1 2,47.98 v2.02,48 | v34.08,37 34.25,37 | v34.08,43 34.25,43 | v15.8,59.3 15.65,59.3 | v8.03,38.6 7.97,38.65
  Top 0.406: 17.62,24 20.75,24 v22.5,22.25
  Bottom 0.406: v22.5,22.25 22.12,21.88
  pour Bottom: 0,0 38,0 38,66 0,66
LASER_PWM_IN  (via drill 0.41)
  Top 0.178: R16.2 21.6,18.15 v18.43,21.32 | v15.9,23.85 15.9,24.27 16.25,24.62 16.25,26.75 15.22,27.77 15.22,28.15 U$1.P40
  Bottom 0.178: v15.9,23.85 v18.43,21.32
MISO  (via drill 0.41)
  Top 0.178: v25.55,33.5 24.2,33.5 23.52,32.83 23.45,32.83 U$1.P16 | v15.53,24.93 9.93,24.93 JP1.9
  Bottom 0.178: v25.55,33.5 25.55,33.3 27.6,31.25 27.6,30.65 21.88,24.93 v15.53,24.93
MOSI  (via drill 0.41)
  Top 0.178: v23.8,34.2 23.8,34 23.1,33.3 23.1,33.2 U$1.P17 | v11.47,23 10.53,23 5.28,17.75 JP1.7
  Bottom 0.178: v23.8,34.2 16.35,26.75 15.22,26.75 v11.47,23
N$1
  Top 0.178: C3.1 15.75,13.85 REG1.BYPASS
N$2  (via drill 0.41)
  Top 0.178: R2.2 26.65,30.15 26.1,30.7 v25.05,30.7 | v22.8,31.7 22.45,31.7 18.5,35.65 U$1.P25
  Bottom 0.178: v25.05,30.7 24.05,31.7 v22.8,31.7
N$3
  Top 0.178: LED2.A 31.4,33.25 R2.1
N$4  (via drill 0.41)
  Top 0.178: REG1.IN 18.45,12.05 19.02,12.62 19.02,13.38 18.45,13.95 REG1.INHIBIT 18.1,14.03 18.1,17.9 18.07,17.93 18.07,19.15 18.18,19.62 19.43,19.62 20.9,17.9 v20.9,15.03 | D2.1 5.9,47.25 C1.1 8.05,45.08 9.78,43.35 v9.78,40.95
  Bottom 0.178: v20.9,15.03 20.93,15 20.93,14.55 19.95,13.57 16.05,13.57 10,19.62 10,34.83 10.6,35.42 10.6,36.42 9.78,37.25 v9.78,40.95
N$5
  Top 0.178: R4.2 2,43.77 3.55,42.98 3.55,37.7 4.17,37.08 U$3.P4
N$6  (via drill 0.41)
  Top 0.178: v7.2,51.95 R11.1 | v16,47.92 15.1,47.92 14.45,47.27 IC3.10
  Bottom 0.178: v7.2,51.95 11.97,51.95 v16,47.92
N$7  (via drill 0.41)
  Top 0.178: U$2.1 33.02,58.05 31.12,59.95 U$2.4 v29.15,59.95 | U$11.P6 14.85,64.2 15.45,64.8 21.45,64.8 23.25,63 JP7.1
  Bottom 0.178: v29.15,59.95 26.57,62.52 23.75,62.52 JP7.1
N$8  (via drill 0.41)
  Top 0.178: R12.1 2,53.3 v2.3,53 | v16,44.08 15.1,44.08 14.45,44.73 IC3.12
  Bottom 0.178: v2.3,53 4.47,53 13.4,44.08 v16,44.08
N$9  (via drill 0.41)
  Top 0.178: U$11.P1 14.85,60.1 U$4.4 | U$4.4 | U$4.1 15.93,58.05 15.38,57.5 14.03,57.5 13.82,57.7 13.82,59.05 13.96,59.19 | 13.96,59.19 14.65,59.88 U$4.4 | 13.96,59.19 v13.15,60
  Bottom 0.178: JP8.1 10.15,63 v13.15,60
N$10  (via drill 0.41)
  Top 0.178: R10.1 30.4,54.15 29.27,53.02 v27.65,53.02 | v16.12,50.9 15.53,50.9 14.45,49.83 IC3.8
  Bottom 0.178: v27.65,53.02 27,53.67 19.82,53.67 17.05,50.9 v16.12,50.9
N$11  (via drill 0.41)
  Top 0.178: R9.1 27.75,54.15 v26.55,52.95 | v19,49.2 19.9,49.2 20.55,48.55 IC3.6
  Bottom 0.178: v26.55,52.95 22.8,49.2 v19,49.2
N$12
  Top 0.178: LED1.A 35,35.9 35.67,35.23 35.67,34.27 35.42,34.02 32.05,34.02 30.23,35.85 R3.1
N$13
  Top 0.178: R3.2 28.27,34.15 25.55,31.43 24.75,31.43 24.3,30.98 22.45,30.98 18.15,35.27 U$1.P26
N$14
  Top 0.178: 5.03,39.02 U$3.P1 5.1,39.08 6.15,40.12 L1.2
N$15
  Top 0.178: U$8.1 17.3,5.67 U$14.P$2 15.75,4 17.52,2.23 20.48,2.23 20.68,2.42 20.68,5.58 20,6.25 U$9.ANODE | U$8.1
N$16  (via drill 0.41)
  Top 0.178: U$11.P4 19.73,64 JP7.2 20.77,62.92 22.68,61.02 22.68,59.95 U$5.4 | U$5.1 24.2,58.05 v24.05,58.2
  Bottom 0.178: v24.05,58.2 24.05,58.67 20.75,61.98 20.75,63 JP7.2
N$17  (via drill 0.41)
  Top 0.178: U$11.P3 16.15,61.2 v16.3,61.05 | v10.85,58.25 9.53,58.25 9.32,58.05 U$6.1 | v8.05,59.95 U$6.4
  Bottom 0.178: v16.3,61.05 13.5,58.25 v10.85,58.25 10.78,58.3 9.12,59.95 v8.05,59.95 8,60.02 8,60.58 6.75,61.83 6.75,63 JP8.2
N$18
  Top 0.178: LD1.P$3 33.77,20 33.77,14.47 31.93,10.62 31.93,8.35 27,3.42 Q1.4
N$19  (via drill 0.41)
  Top 0.178: 22.88,12.15 R14.2 | 22.88,12.15 24.7,10.32 Q1.3 | R13.2 27.62,17.15 v26.88,17.9 | v24.88,15.9 24.88,14.18 22.93,12.22 22.88,12.15
  Bottom 0.178: v24.88,15.9 v26.88,17.9
N$20
  Top 0.178: C8.2 R14.1 22.07,13.9 22.85,14.68 24.05,14.68 U1.4
N$21
  Top 0.178: R15.2 30.25,11.28 29.3,10.32 Q1.1
N$22  (via drill 0.41)
  Top 0.178: C8.1 20.23,12.15 23.85,8.53 30.15,8.53 31.07,9.45 31.07,14.03 R15.1 30.2,14.93 29.68,15.45 v29.68,16 | U1.1 26.27,17.3 v27.57,16 | U1.1
  Bottom 0.178: v29.68,16 v27.57,16
N$23
  Top 0.178: 24.18,19.85 24.7,19.85 R25.2 | 24.18,19.85 24.05,19.85 | 24.05,19.85 R16.1 | C9.1 27,20.45 27.77,21.23 27.77,23.77 26.57,24.98 25.43,24.98 24.18,23.73 24.18,19.85 | 24.05,19.85 U1.3
N$24
  Top 0.178: LED3.A 34.3,39.25 30.62,42.92 29.38,42.92 29.18,42.73 29.18,38.98 R20.1
N$25  (via drill 0.41)
  Top 0.178: C15.1 R17.1 18.18,5.08 18.18,9.35 17.62,9.9 17.38,9.9 U$8.3 | R18.2 10,10.7 10.85,11.55 v10.85,12.45 | v15.95,9.85 17.2,9.85 U$8.3 | U$8.3
  Bottom 0.178: v10.85,12.45 13.35,12.45 v15.95,9.85
N$26  (via drill 0.41)
  Top 0.178: R19.2 8.12,9.85 v9.22,10.95 | v13.18,9.85 14.57,9.85 14.68,9.95 U$8.4
  Bottom 0.178: v9.22,10.95 12.07,10.95 v13.18,9.85
N$27
  Top 0.178: LED4.A 35,42.6 35.67,43.27 35.67,44.23 35.48,44.42 30.57,44.42 R21.1
N$28  (via drill 0.41)
  Top 0.178: R20.2 30,39.55 30.82,38.73 30.82,37.58 30.62,37.38 25.98,37.38 23.75,39.6 v21.18,39.6 | v19.2,37.62 17.35,35.77 17.35,35.35 17.75,34.95 U$1.P27
  Bottom 0.178: v19.2,37.62 v21.18,39.6
N$29  (via drill 0.41)
  Top 0.178: R21.2 30,41.25 31.2,40.05 31.2,37.42 30.4,36.62 29.38,36.62 29.18,36.42 29.18,35.27 29.52,34.92 30.62,34.92 30.82,34.73 30.82,33.58 29.88,32.62 28.55,32.62 v26.88,30.95 | v25.85,29.93 24.8,29.93 24.12,30.6 21.4,30.6 17.43,34.58 U$1.P28
  Bottom 0.178: v25.85,29.93 v26.88,30.95
NRST  (via drill 0.41)
  Top 0.178: v31.7,32.52 31.7,30.45 28.57,27.32 23.38,27.32 22.85,27.85 22.73,27.85 U$1.P7 | v32.35,34.75 32.35,36.3 34.62,38.58 35.48,38.58 36.05,39.15 36.05,45.42 31.75,49.73 JP2.1
  Bottom 0.178: v31.7,32.52 31.7,34.1 v32.35,34.75
SCK  (via drill 0.41)
  Top 0.178: v26.2,34.4 26.27,34.33 26.27,33.2 25.85,32.77 25.25,32.77 25.12,32.9 24.32,32.9 23.9,32.48 23.8,32.48 U$1.P15
  Bottom 0.178: v26.2,34.4 26.2,33.88 27.98,32.1 27.98,21.07 20.1,13.2 12.22,13.2 10.25,15.18 5.28,15.18 JP1.5
SCL  (via drill 0.41)
  Top 0.178: v22.77,24.65 22.8,24.68 22.8,26.98 22.38,27.4 22.38,27.5 U$1.P6 | v15.9,22.35 14.9,22.35 13.57,23.68 12.43,23.68 12.2,23.45 12.2,22.7 5.72,16.23 4.85,16.23 3.77,15.15 3.77,13.68 2.75,12.65 JP1.4
  Bottom 0.178: v22.77,24.65 18.73,20.6 17.65,20.6 v15.9,22.35
SDA  (via drill 0.41)
  Top 0.178: v19.77,26.68 20.7,27.6 21.48,27.6 21.9,27.18 22,27.18 U$1.P5 | v15.53,26.02 12.07,26.02 11.35,25.3 9.22,25.3 5.22,21.3 4.83,21.3 3.77,20.25 3.77,19.85 2.7,18.77 2.3,18.77 1.7,18.18 1.7,16.23 JP1.6
  Bottom 0.178: v19.77,26.68 19.12,26.02 v15.53,26.02
SPI_CS  (via drill 0.41)
  Top 0.178: v19.55,35.7 19.55,35.48 21.93,33.1 22.18,33.1 22.6,33.52 22.7,33.52 U$1.P18 | v11.7,21.18 11.7,19.07 JP1.3
  Bottom 0.178: v19.55,35.7 19.55,35.08 12.7,28.23 11.7,28.23 10.75,27.27 10.75,22.12 v11.7,21.18
SWCLK  (via drill 0.41)
  Top 0.178: v13.3,30.38 14.03,29.65 14.57,29.65 U$1.P37 | v13.35,36.02 16.05,36.02 v18.6,38.58 | v20.4,40.38 20.48,40.38 29.57,49.48 v29.57,50.08
  Bottom 0.178: v13.3,30.38 13.3,35.98 v13.35,36.02 | v20.4,40.38 v18.6,38.58 | v29.57,50.08 31.75,52.25 JP2.2
SWDIO  (via drill 0.41)
  Top 0.178: v12.57,34.2 13.47,34.2 15.2,32.48 15.28,32.48 U$1.P34 | v17.65,44.48 17.65,45.12 v18.55,46.02 | v22.73,46.02 24.5,46.02 29.27,50.8 32.12,50.8 33.17,49.75 34.25,49.75 JP2.3
  Bottom 0.178: v12.57,34.2 12.57,39.1 17.65,44.17 v17.65,44.48 | v22.73,46.02 v18.55,46.02
USB_DM  (via drill 0.41)
  Top 0.178: U$12.P1 6.62,39.65 6.29,39.31 | 6.29,39.31 5.35,38.38 U$3.P2 | v9.88,35.73 10.3,35.3 13.78,35.3 15.88,33.2 16,33.2 U$1.P32 | 6.29,39.31 v6.9,38.7
  Bottom 0.178: v6.9,38.7 v9.88,35.73
USB_DP  (via drill 0.41)
  Top 0.178: U$12.P3 8.8,38.35 v7.22,36.77 | v6.1,37.9 4.95,37.9 U$3.P3 | v9.1,34.92 13.45,34.92 15.55,32.83 U$1.P33
  Bottom 0.178: v6.1,37.9 v7.22,36.77 7.3,36.73 v9.1,34.92
VUSB
  Top 0.305: C22.1 28,60.35 29.77,62.12 | U$10.CATHODE 29.82,62.17 | 29.82,62.17 29.77,62.12 | U$2.2 32.92,59 31.65,60.27 31.65,60.35 29.82,62.17 | C24.1 19.62,59.85 18.77,59 U$4.2 | C24.1 20.15,59.8 20.95,59 U$5.2 25.45,59.05 25.73,59.05 26.25,59.58 26.25,63.42 26.77,63.95 27.95,63.95 29.77,62.12 | 15.5,63.6 U$11.P5 | 15.5,63.6 12,60.1 C23.1 11.85,59.8 11.1,59.05 9.45,59.05 U$6.2 6.33,59 5.47,59.85 C25.1 3.95,59.7 3.95,59.6 3.1,58.75 3.1,46.75 4.95,44.9 D2.2 5.15,44.73 5.92,44.73 7.65,43 L1.1 7.9,42.85 7.9,41.7 10.6,39 | C24.1 19.57,60 16.23,63.35 15.85,63.35 15.65,63.55 15.5,63.6 | U$8.5 14.68,8.05 14.68,6.7 12.28,4.3 U$14.P$1 12.22,4.15 C16.1 9.95,4.3 8,6.25 R19.1 7.85,8.2 3.08,8.2 1.27,10 1.27,28.82 6.95,34.5 U$13.CATHODE 7,35.3 10.55,38.85 10.6,39 | 10.6,39 U$12.P5
XBARDUAL_OUT  (via drill 0.41)
  Top 0.178: C6.1 35,55.55 35.77,54.77 35.77,52.3 34.7,51.23 33.85,51.23 32.83,52.25 32.83,55 32.05,55.77 R10.2 R9.2 29.02,55.92 v29.02,57.25 | v25.4,60.88 25.32,60.8 25.32,59.95 U$5.3
  Bottom 0.178: v29.02,57.25 v25.4,60.88
XCOARSE_IN  (via drill 0.41)
  Top 0.178: R5.1 22.38,54.15 v19.52,51.3 | v18.4,50.17 18.4,49.62 18.27,49.5 18.27,48.9 19.9,47.27 20.55,47.27 IC3.5 19.85,47.2 19.27,46.62 19.27,45.73 18.43,44.88 v18.43,43.7 | v14.07,31.15 14.32,31.15 15.38,30.1 15.38,29.82 14.95,29.4 U$1.P38
  Bottom 0.178: v18.4,50.17 v19.52,51.3 | v14.07,31.15 14.07,39.35 v18.43,43.7
XDUAL_OUT
  Top 0.178: R6.2 R5.2 25.23,55.85 | 25.23,55.85 C4.1 | U$2.3 33.58,59.95 36.15,57.38 36.15,52.15 34.85,50.85 32.6,50.85 32.23,51.23 27.25,51.23 25.23,53.25 25.23,55.85
XFINE_IN  (via drill 0.41)
  Top 0.178: R6.1 19.27,54.15 v17.98,52.85 | IC3.9 14.45,48.55 14.88,48.55 16.85,50.52 v16.85,51.73 16.8,51.8 16.62,51.98 16.62,52.92 14.62,54.92 10.38,54.92 10.18,54.73 10.18,53.58 11.57,52.17 11.57,38.08 11.38,37.88 v11.38,36.02 | v11.38,31.82 10.57,31.02 9.47,31.02 9.22,30.77 9.22,29.52 9.78,28.98 14.03,28.98 14.5,28.5 14.75,28.5 15.18,28.93 15.28,28.93 U$1.P39
  Bottom 0.178: v16.85,51.73 v17.98,52.85 | v11.38,36.02 v11.38,31.82
YBARDUAL_OUT  (via drill 0.41)
  Top 0.178: 2,57 2,59.25 3.42,60.67 8.57,60.67 U$6.3 | 2,57 R12.2 | U$6.3 | R11.2 4.7,55.85 v3.9,56.65 | 2,57 v2.3,57 | C7.1 8.38,55.85 v9.1,56.58
  Bottom 0.178: v2.3,57 3.55,57 v3.9,56.65 3.98,56.6 9.07,56.6 v9.1,56.58
YCOARSE_IN  (via drill 0.41)
  Top 0.178: R7.1 14,51.1 13.12,50.23 13.12,46.88 14,46 IC3.11 14.5,45.95 15.15,45.95 18.9,42.2 v18.9,41.88 | v23.07,35.15 22.32,35.15 21.77,34.6 21.68,34.6 U$1.P21
  Bottom 0.178: v23.07,35.15 23.07,38.73 19.93,41.88 v18.9,41.88
YDUAL_OUT  (via drill 0.41)
  Top 0.178: R8.2 R7.2 C5.1 17.05,55.92 18.55,57.42 v18.55,58.2 | U$4.3 18.5,59.95 v18.55,59.9
  Bottom 0.178: v18.55,58.2 v18.55,59.9
YFINE_IN  (via drill 0.41)
  Top 0.178: R8.1 11,53.27 12.75,51.52 12.75,44.7 13.97,43.48 14.43,43.48 IC3.13 13.93,43.4 13.12,42.6 13.12,41.77 15.55,39.35 18.85,39.35 20.3,37.9 v20.3,37.7 | v22.25,35.88 21.32,34.95 U$1.P22
  Bottom 0.178: v22.25,35.88 20.43,37.7 v20.3,37.7

### Text on the board
Bottom: PeachyD v1.8 / Bottom Side